# Altium schematic sheet WLB_DOC.SchDoc
size A
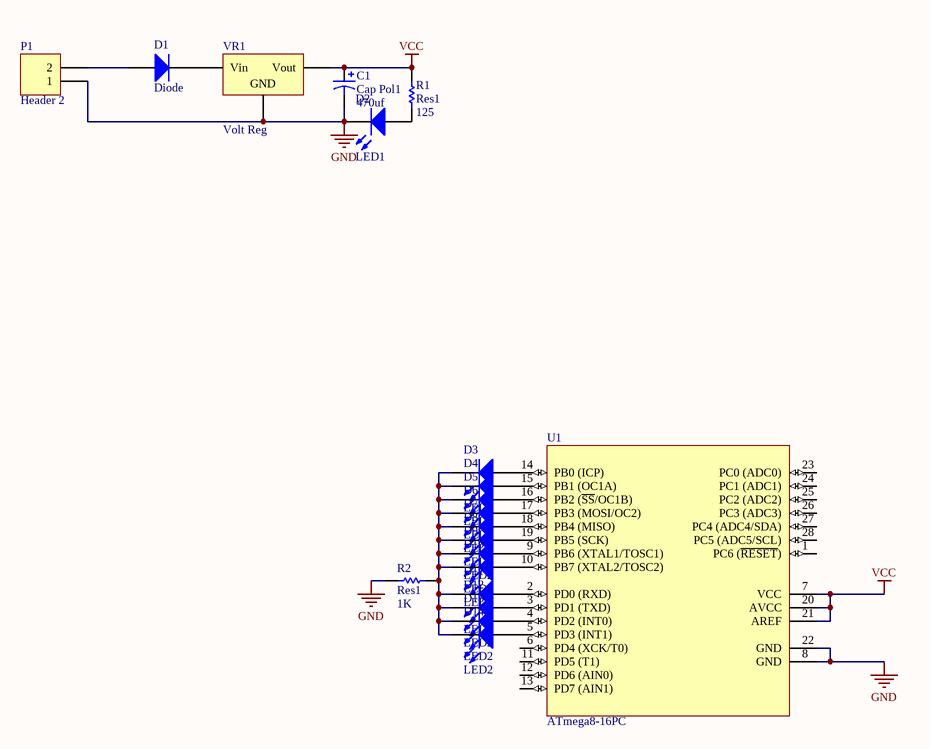
[diagram p0: WLB_DOC.SchDoc]

## Parts
C1  Cap Pol1  value 470uf  [RB7.6-15]
D1  Diode  [SMC]
D2  LED1  [LED-1]
D3  LED2  [3.2X1.6X1.1]
D4  LED2  [3.2X1.6X1.1]
D5  LED2  [3.2X1.6X1.1]
D6  LED2  [3.2X1.6X1.1]
D7  LED2  [3.2X1.6X1.1]
D8  LED2  [3.2X1.6X1.1]
D9  LED2  [3.2X1.6X1.1]
D10  LED2  [3.2X1.6X1.1]
D11  LED2  [3.2X1.6X1.1]
D12  LED2  [3.2X1.6X1.1]
D13  LED2  [3.2X1.6X1.1]
D14  LED2  [3.2X1.6X1.1]
P1  Header 2  [HDR1X2]
R1  Res1  value 125  [AXIAL-0.3]
R2  Res1  value 1K  [AXIAL-0.3]
U1  ATmega8-16PC  [28P3]
VR1  Volt Reg  [D2PAK_N]

## Nets
GND: C1.2 D2.2(K) P1.1 R2.1 U1.8(GND) U1.22(GND) VR1.2(GND)
VCC: C1.1 R1.2 U1.7(VCC) U1.20(AVCC) U1.21(AREF) VR1.3(Vout)
NetD1_1: D1.1(A) P1.2
NetD1_2: D1.2(K) VR1.1(Vin)
NetD2_1: D2.1(A) R1.1
NetD3_1: D3.1(A) U1.14(PB0_(ICP))
NetD3_2: D3.2(K) D4.2(K) D5.2(K) D6.2(K) D7.2(K) D8.2(K) D9.2(K) D10.2(K) D11.2(K) D12.2(K) D13.2(K) D14.2(K) R2.2
NetD4_1: D4.1(A) U1.15(PB1_(OC1A))
NetD5_1: D5.1(A) U1.16(PB2_(~{SS}/OC1B))
NetD6_1: D6.1(A) U1.17(PB3_(MOSI/OC2))
NetD7_1: D7.1(A) U1.18(PB4_(MISO))
NetD8_1: D8.1(A) U1.19(PB5_(SCK))
NetD9_1: D9.1(A) U1.9(PB6_(XTAL1/TOSC1))
NetD10_1: D10.1(A) U1.10(PB7_(XTAL2/TOSC2))
NetD11_1: D11.1(A) U1.2(PD0_(RXD))
NetD12_1: D12.1(A) U1.3(PD1_(TXD))
NetD13_1: D13.1(A) U1.4(PD2_(INT0))
NetD14_1: D14.1(A) U1.5(PD3_(INT1))

Not connected (* = marked no-connect by the designer): U1 1(PC6_(~{RESET})) 6(PD4_(XCK/T0)) 11(PD5_(T1)) 12(PD6_(AIN0)) 13(PD7_(AIN1)) 23(PC0_(ADC0)) 24(PC1_(ADC1)) 25(PC2_(ADC2)) 26(PC3_(ADC3)) 27(PC4_(ADC4/SDA)) 28(PC5_(ADC5/SCL))

## Library data of the parts
C1 = Cap Pol1: Polarized Capacitor (Radial); Published: 8-Jun-2000; LatestRevisionDate: 17-Jul-2002; LatestRevisionNote: Re-released for DXP Platform.; PackageReference: RB7.6-15; Publisher: Altium Limited; PackageDescription: Polarized Capacitor (Radial); 2 Leads
D1 = Diode: Default Diode; Published: 8-Jun-2000; LatestRevisionDate: 17-Jul-2002; LatestRevisionNote: Re-released for DXP Platform.; PackageVersion: Sep-1996; PackageReference: SMC; Publisher: Altium Limited; PackageDescription: DO-214-AB/SMC; 2 C-Bend Leads; Body 7.9 x 5.9 mm, inc. leads (LxW); Code_JEDEC: DO-214-AB
D2 = LED1: Typical RED GaAs LED; Published: 8-Jun-2000; LatestRevisionDate: 08-Jul-2005; LatestRevisionNote: Mech Layer 1 removed.; PackageReference: LED-1; Publisher: Altium Limited; PackageDescription: LED; 2 Leads
D3-D14 = LED2: Typical RED, GREEN, YELLOW, AMBER GaAs LED; Published: 8-Jun-2000; LatestRevisionDate: 17-Jul-2002; LatestRevisionNote: Re-released for DXP Platform.; PackageVersion: Feb-2002; PackageReference: 3.2X1.6X1.1; Publisher: Altium Limited; PackageDescription: SM LED; 2 Flat Leads
P1 = Header 2: Header, 2-Pin; LatestRevisionDate: 17-Jul-2002; LatestRevisionNote: Re-released for DXP Platform.; Publisher: Altium Limited
R1 R2 = Res1: Resistor; Published: 8-Jun-2000; LatestRevisionDate: 17-Jul-2002; LatestRevisionNote: Re-released for DXP Platform.; PackageReference: AXIAL-0.3; Publisher: Altium Limited; PackageDescription: Axial Device, Thru-Hole; 2 Leads; 0.3 in Pin Spacing
U1 = ATmega8-16PC: 8-Bit AVR Microcontroller with 8K Bytes of In-System Programmable Flash Memory; Published: 17-Sep-2003; LatestRevisionDate: 04-Mar-2005; LatestRevisionNote: Stylized 3D Model Added.; DatasheetVersion: 2486H-AVR-09/02; PackageVersion: revB, Sep-2001; PackageReference: 28P3; Publisher: Altium Limited; PackageDescription: DIP; 28 Leads; Row Spacing 7.62 mm; Pitch 2.54 mm; ComponentLink1Description: Manufacturer Link; ComponentLink1URL: http://www.atmel.com; ComponentLink2Description: Datasheet; ComponentLink2URL: http://www.atmel.com/dyn/resources/prod_documents/doc2486.pdf
VR1 = Volt Reg: Voltage Regulator; Published: 24-Mar-1999; LatestRevisionDate: 29-May-2009; LatestRevisionNote: IPC-7351 Footprint Added.; PackageReference: D2PAK; Publisher: Altium Limited; PackageDescription: 3-Pin Transistor Outline Package 2.54 mm Pitch, 15.1 mm Lead Span